# EAGLE design my_dac_amp_vB (EAGLE 6.4)
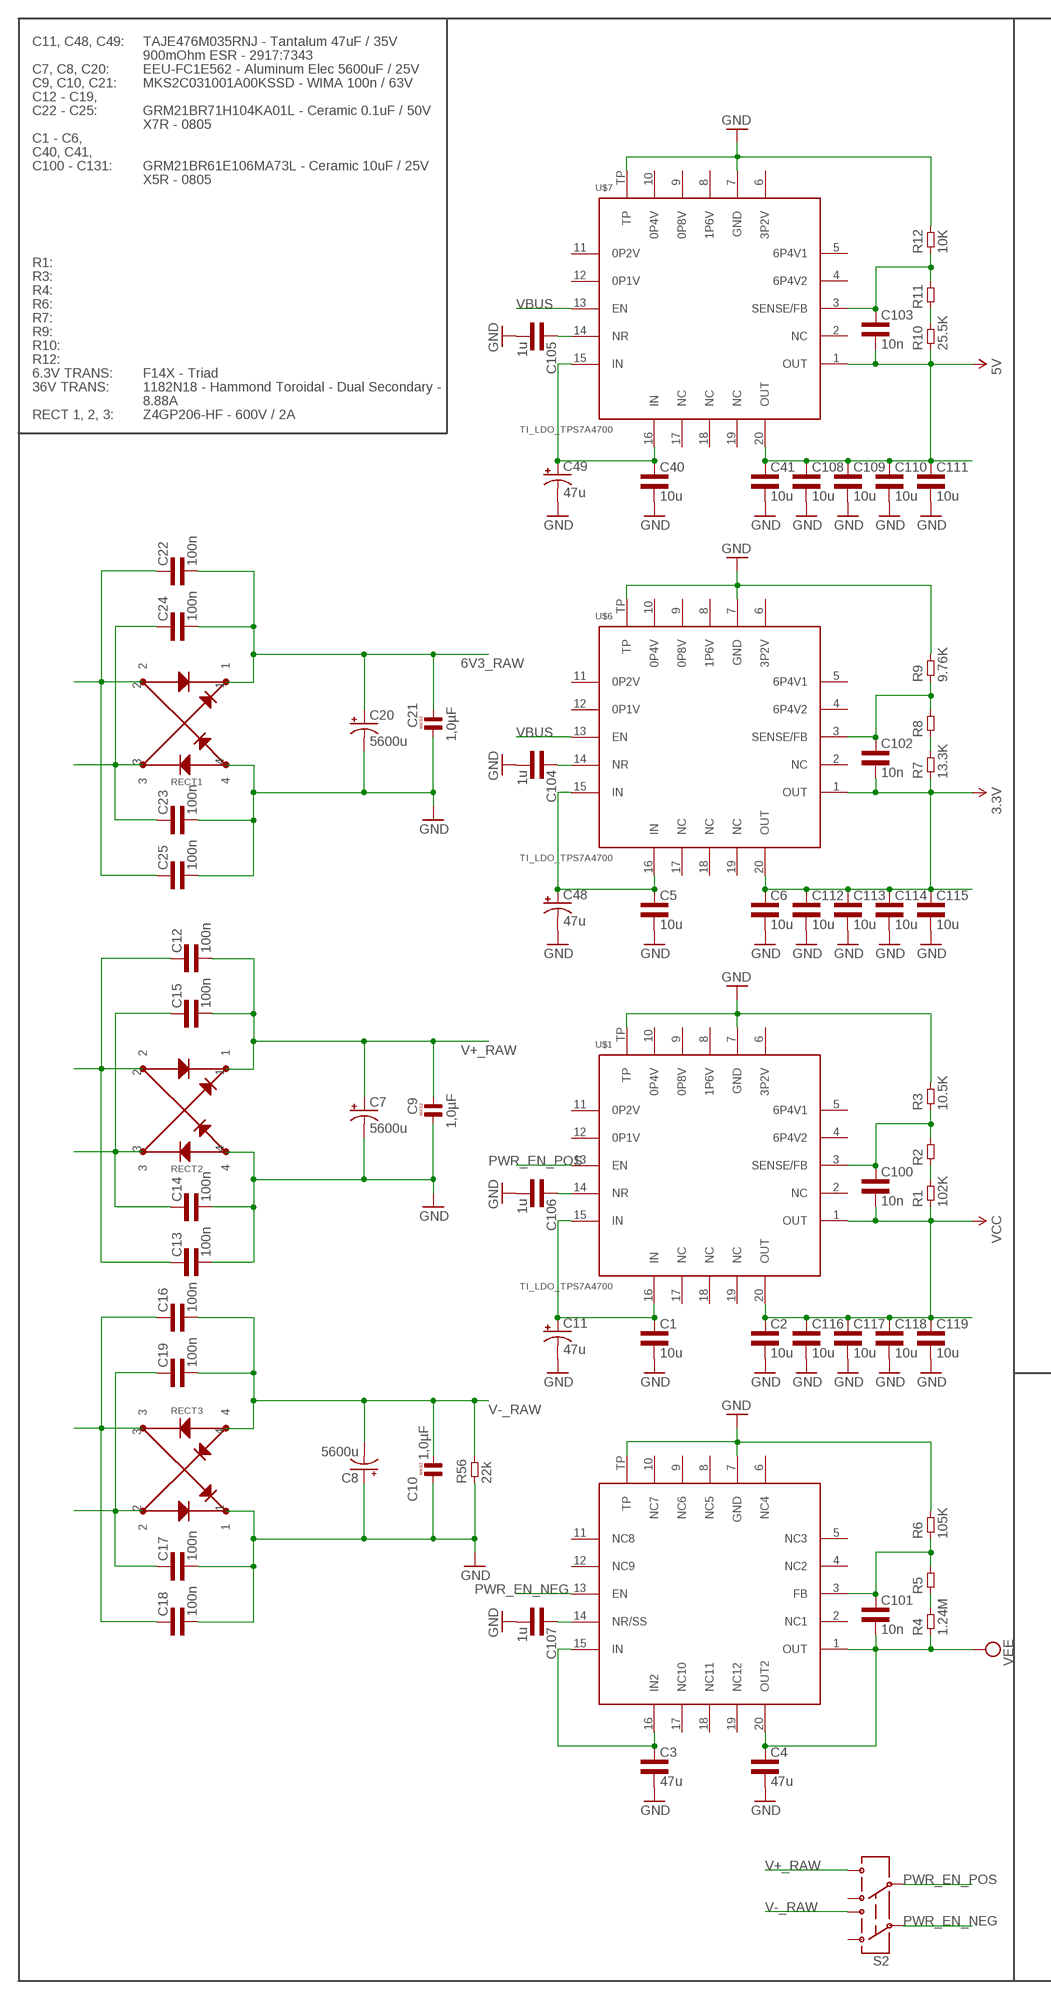
[diagram p0: schematic, sheet 1, part 1 of 2]
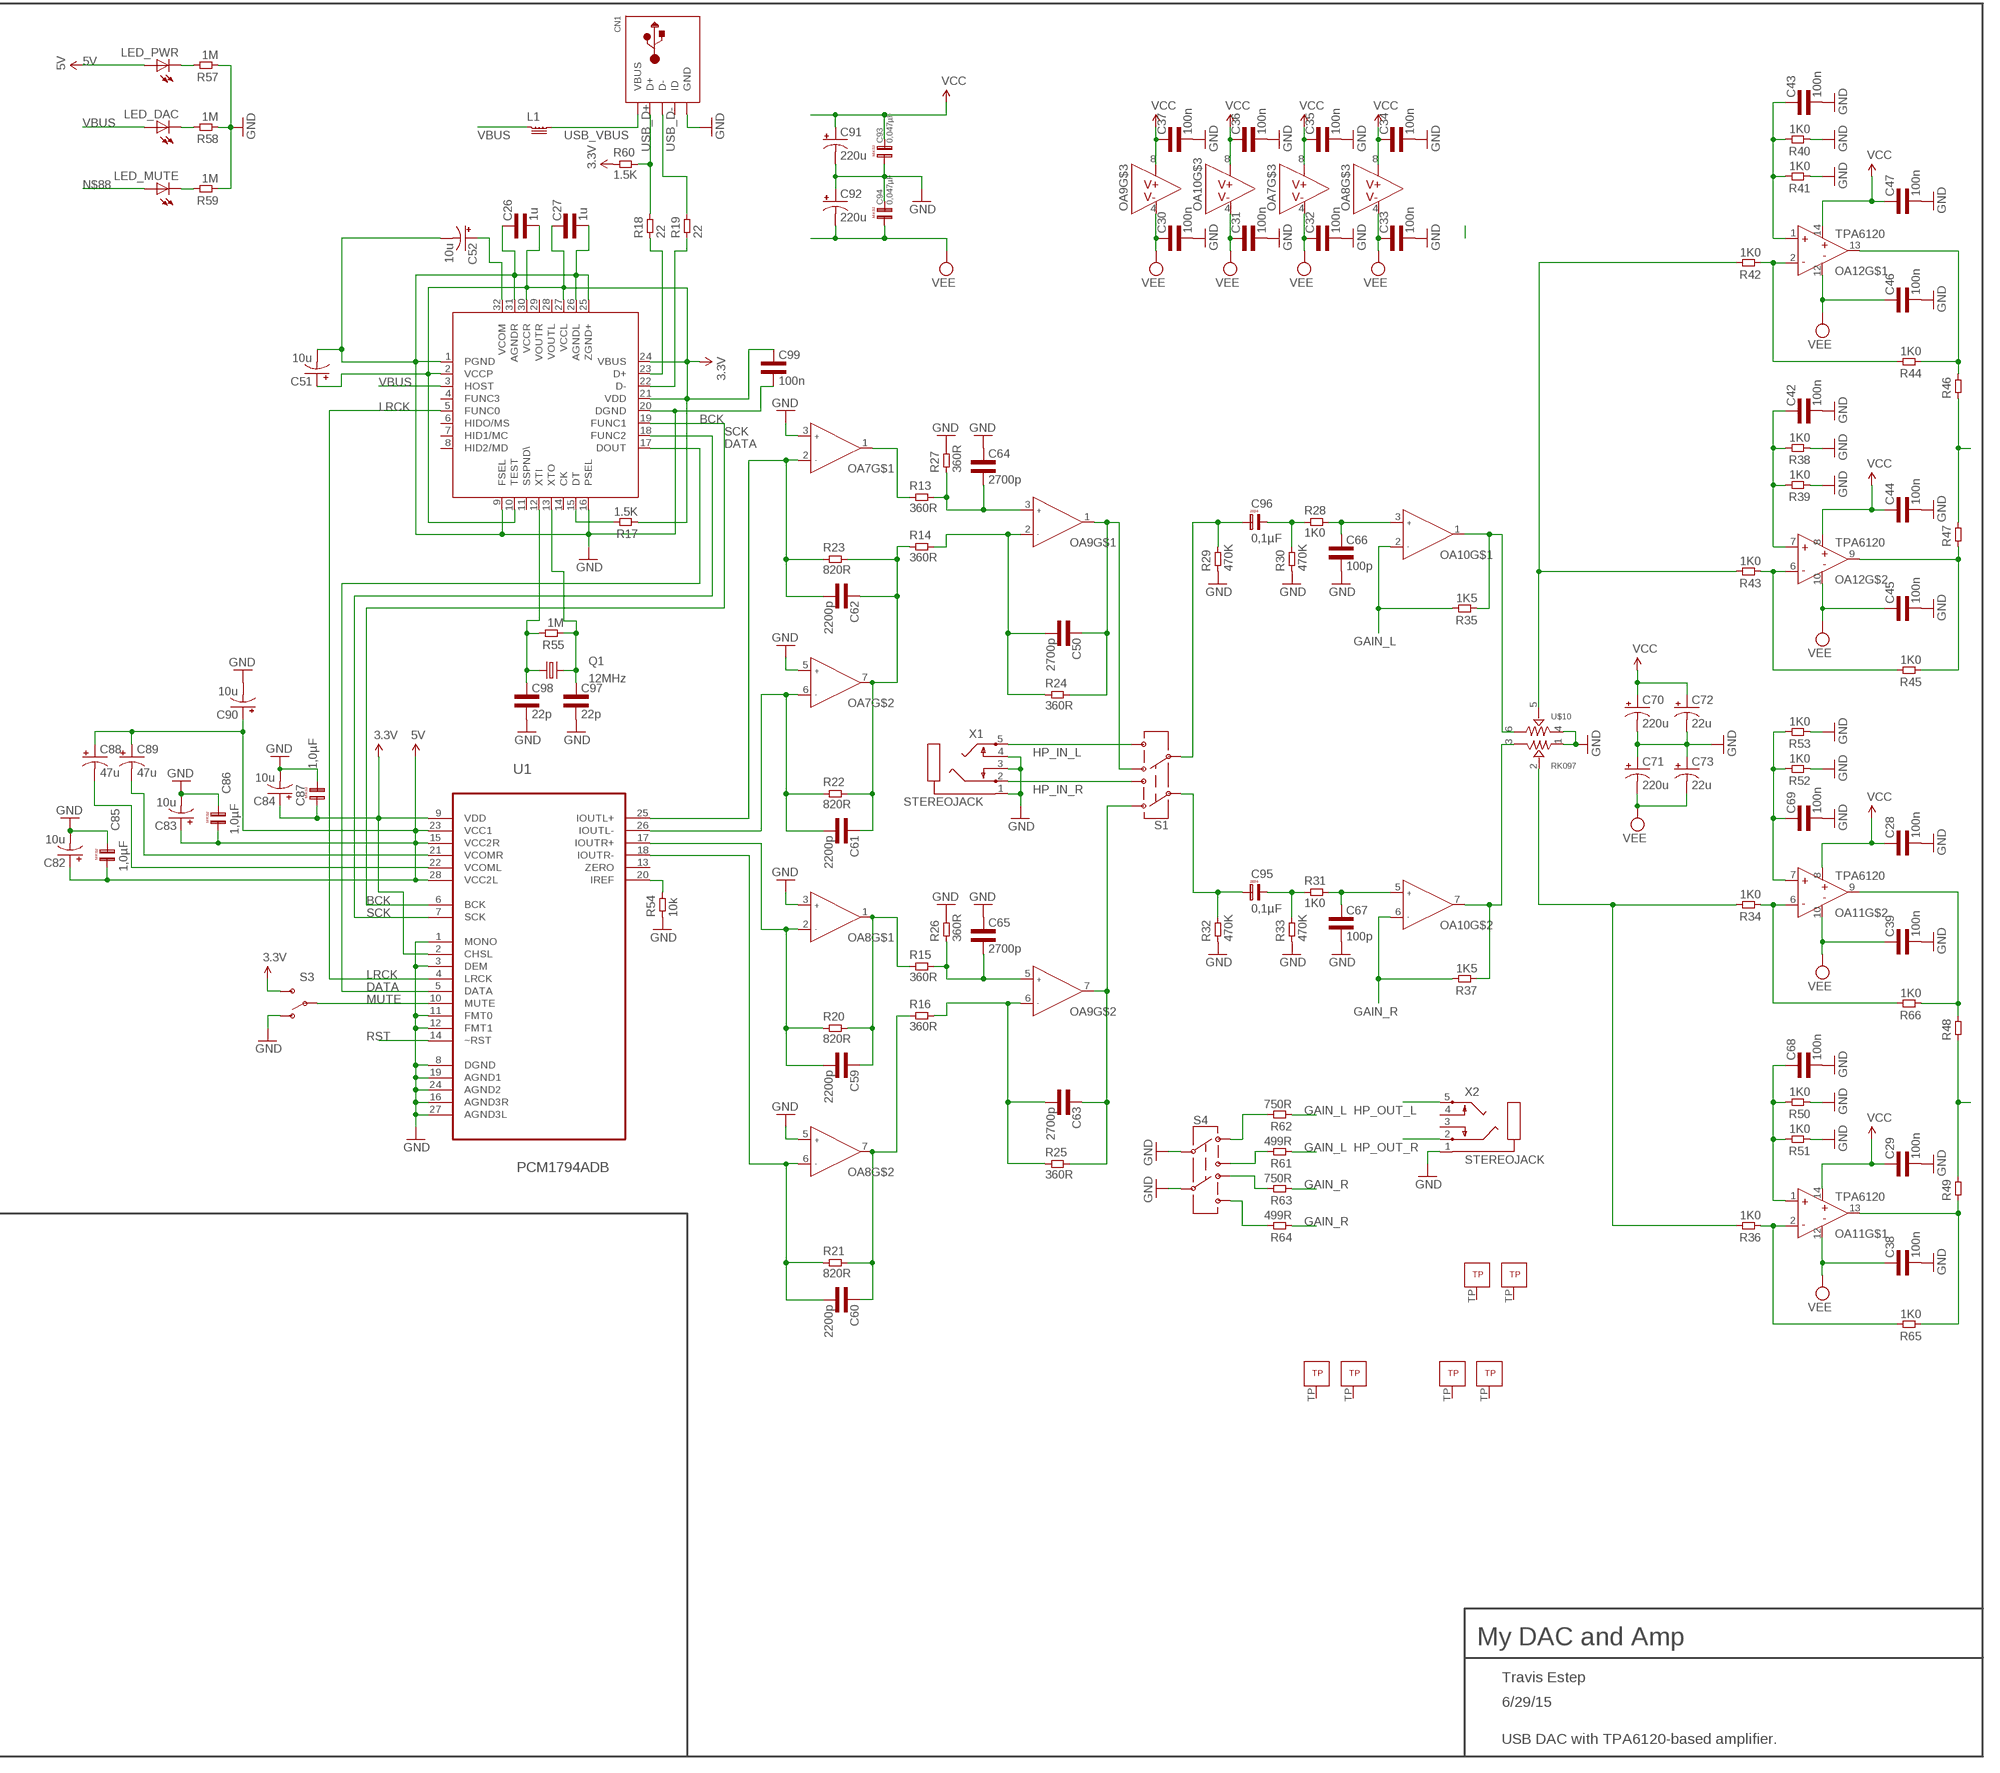
[diagram p1: schematic, sheet 1, part 2 of 2]

## Parts
C1  10u  CAP1206L3  [1206L3]
C2  10u  CAP0805L3  [0805L3]
C3  47u  CAP1206L3  [1206L3]
C4  47u  CAP1206L3  [1206L3]
C5  10u  CAP1206L3  [1206L3]
C6  10u  CAP0805L3  [0805L3]
C7  5600u  CPOL-USE7.5-16  [E7,5-16]
C8  5600u  CPOL-USE7.5-16  [E7,5-16]
C9  1,0µF  [R5B5]
C10  1,0µF  [R5B5]
C11  47u  CPOL-USSMCE  [SMC_E]
C12  100n  CAP0805L3  [0805L3]
C13  100n  CAP0805L3  [0805L3]
C14  100n  CAP0805L3  [0805L3]
C15  100n  CAP0805L3  [0805L3]
C16  100n  CAP0805L3  [0805L3]
C17  100n  CAP0805L3  [0805L3]
C18  100n  CAP0805L3  [0805L3]
C19  100n  CAP0805L3  [0805L3]
C20  5600u  CPOL-USE7.5-16  [E7,5-16]
C21  1,0µF  [R5B5]
C22  100n  CAP0805L3  [0805L3]
C23  100n  CAP0805L3  [0805L3]
C24  100n  CAP0805L3  [0805L3]
C25  100n  CAP0805L3  [0805L3]
C26  1u  CAP0603L3  [0603L3]
C27  1u  CAP0603L3  [0603L3]
C28  100n  CAP0603L3  [0603L3]
C29  100n  CAP0603L3  [0603L3]
C30  100n  CAP0603L3  [0603L3]
C31  100n  CAP0603L3  [0603L3]
C32  100n  CAP0603L3  [0603L3]
C33  100n  CAP0603L3  [0603L3]
C34  100n  CAP0603L3  [0603L3]
C35  100n  CAP0603L3  [0603L3]
C36  100n  CAP0603L3  [0603L3]
C37  100n  CAP0603L3  [0603L3]
C38  100n  CAP0603L3  [0603L3]
C39  100n  CAP0603L3  [0603L3]
C40  10u  CAP1206L3  [1206L3]
C41  10u  CAP0805L3  [0805L3]
C42  100n  CAP0603L3  [0603L3]
C43  100n  CAP0603L3  [0603L3]
C44  100n  CAP0603L3  [0603L3]
C45  100n  CAP0603L3  [0603L3]
C46  100n  CAP0603L3  [0603L3]
C47  100n  CAP0603L3  [0603L3]
C48  47u  CPOL-USSMCE  [SMC_E]
C49  47u  CPOL-USSMCE  [SMC_E]
C50  2700p  CAP0603L3  [0603L3]
C51  10u  CPOL-USE3.5-8  [E3,5-8]
C52  10u  CPOL-USE3.5-8  [E3,5-8]
C59  2200p  CAP0603L3  [0603L3]
C60  2200p  CAP0603L3  [0603L3]
C61  2200p  CAP0603L3  [0603L3]
C62  2200p  CAP0603L3  [0603L3]
C63  2700p  CAP0603L3  [0603L3]
C64  2700p  CAP0603L3  [0603L3]
C65  2700p  CAP0603L3  [0603L3]
C66  100p  CAP0603L3  [0603L3]
C67  100p  CAP0603L3  [0603L3]
C68  100n  CAP0603L3  [0603L3]
C69  100n  CAP0603L3  [0603L3]
C70  220u  CPOL-USE5-13  [E5-13]
C71  220u  CPOL-USE5-13  [E5-13]
C72  22u  CPOL-USE3.5-8  [E3,5-8]
C73  22u  CPOL-USE3.5-8  [E3,5-8]
C82  10u  CPOL-USE3.5-8  [E3,5-8]
C83  10u  CPOL-USE3.5-8  [E3,5-8]
C84  10u  CPOL-USE3.5-8  [E3,5-8]
C85  1,0µF  [R5B5]
C86  1,0µF  [R5B5]
C87  1,0µF  [R5B5]
C88  47u  CPOL-USE5-10.5  [E5-10,5]
C89  47u  CPOL-USE5-10.5  [E5-10,5]
C90  10u  CPOL-USE3.5-8  [E3,5-8]
C91  220u  CPOL-USE5-13  [E5-13]
C92  220u  CPOL-USE5-13  [E5-13]
C93  0,047µF  [R5B2K5]
C94  0,047µF  [R5B2K5]
C95  0,1µF  [L7,2]
C96  0,1µF  [L7,2]
C97  22p  CAP0603L3  [0603L3]
C98  22p  CAP0603L3  [0603L3]
C99  100n  CAP0603L3  [0603L3]
C100  10n  CAP0603L3  [0603L3]
C101  10n  CAP0603L3  [0603L3]
C102  10n  CAP0603L3  [0603L3]
C103  10n  CAP0603L3  [0603L3]
C104  1u  CAP0603L3  [0603L3]
C105  1u  CAP0603L3  [0603L3]
C106  1u  CAP0603L3  [0603L3]
C107  1u  CAP0603L3  [0603L3]
C108  10u  CAP0805L3  [0805L3]
C109  10u  CAP0805L3  [0805L3]
C110  10u  CAP0805L3  [0805L3]
C111  10u  CAP0805L3  [0805L3]
C112  10u  CAP0805L3  [0805L3]
C113  10u  CAP0805L3  [0805L3]
C114  10u  CAP0805L3  [0805L3]
C115  10u  CAP0805L3  [0805L3]
C116  10u  CAP0805L3  [0805L3]
C117  10u  CAP0805L3  [0805L3]
C118  10u  CAP0805L3  [0805L3]
C119  10u  CAP0805L3  [0805L3]
CN1  USBMINIB  [USB-MINIB]
L1  SRP4020  [4440]
LED_DAC  LED3MM  [LED3MM]
LED_MUTE  LED3MM  [LED3MM]
LED_PWR  LED3MM  [LED3MM]
OA7  OPA1612  [S-PWSON-N8]
OA8  OPA1612  [S-PWSON-N8]
OA9  OPA1612  [S-PWSON-N8]
OA10  OPA1612  [S-PWSON-N8]
OA11  TPA6120QFN  [S-PVQFN-N14]
OA12  TPA6120QFN  [S-PVQFN-N14]
Q1  12MHz  SPARKFUN_CRYSTALHC49US  [SPARKFUN_HC49US]
R1  102K  RES0603L3  [0603L3]
R2  RES0603L3  [0603L3]
R3  10.5K  RES0603L3  [0603L3]
R4  1.24M  RES0603L3  [0603L3]
R5  RES0603L3  [0603L3]
R6  105K  RES0603L3  [0603L3]
R7  13.3K  RES0603L3  [0603L3]
R8  RES0603L3  [0603L3]
R9  9.76K  RES0603L3  [0603L3]
R10  25.5K  RES0603L3  [0603L3]
R11  RES0603L3  [0603L3]
R12  10K  RES0603L3  [0603L3]
R13  360R  RES0603L3  [0603L3]
R14  360R  RES0603L3  [0603L3]
R15  360R  RES0603L3  [0603L3]
R16  360R  RES0603L3  [0603L3]
R17  1.5K  RES0603L3  [0603L3]
R18  22  RES0603L3  [0603L3]
R19  22  RES0603L3  [0603L3]
R20  820R  RES0603L3  [0603L3]
R21  820R  RES0603L3  [0603L3]
R22  820R  RES0603L3  [0603L3]
R23  820R  RES0603L3  [0603L3]
R24  360R  RES0603L3  [0603L3]
R25  360R  RES0603L3  [0603L3]
R26  360R  RES0603L3  [0603L3]
R27  360R  RES0603L3  [0603L3]
R28  1K0  RES0603L3  [0603L3]
R29  470K  RES0603L3  [0603L3]
R30  470K  RES0603L3  [0603L3]
R31  1K0  RES0603L3  [0603L3]
R32  470K  RES0603L3  [0603L3]
R33  470K  RES0603L3  [0603L3]
R34  1K0  RES0603L3  [0603L3]
R35  1K5  RES0603L3  [0603L3]
R36  1K0  RES0603L3  [0603L3]
R37  1K5  RES0603L3  [0603L3]
R38  1K0  RES0603L3  [0603L3]
R39  1K0  RES0603L3  [0603L3]
R40  1K0  RES0603L3  [0603L3]
R41  1K0  RES0603L3  [0603L3]
R42  1K0  RES0603L3  [0603L3]
R43  1K0  RES0603L3  [0603L3]
R44  1K0  RES0603L3  [0603L3]
R45  1K0  RES0603L3  [0603L3]
R46  RES1206L3  [1206L3]
R47  RES1206L3  [1206L3]
R48  RES1206L3  [1206L3]
R49  RES1206L3  [1206L3]
R50  1K0  RES0603L3  [0603L3]
R51  1K0  RES0603L3  [0603L3]
R52  1K0  RES0603L3  [0603L3]
R53  1K0  RES0603L3  [0603L3]
R54  10k  RES0603L3  [0603L3]
R55  1M  RES0603L3  [0603L3]
R56  22k  RES0805L3  [0805L3]
R57  1M  RES0603L3  [0603L3]
R58  1M  RES0603L3  [0603L3]
R59  1M  RES0603L3  [0603L3]
R60  1.5K  RES0603L3  [0603L3]
R61  499R  RES0603L3  [0603L3]
R62  750R  RES0603L3  [0603L3]
R63  750R  RES0603L3  [0603L3]
R64  499R  RES0603L3  [0603L3]
R65  1K0  RES0603L3  [0603L3]
R66  1K0  RES0603L3  [0603L3]
RECT1  Z4GP206  [ABS-4]
RECT2  Z4GP206  [ABS-4]
RECT3  Z4GP206  [ABS-4]
S1  SWITCH-DPDTOS  [OS]
S2  SWITCH-DPDTOS  [OS]
S3  SWITCH-SPDTKIT  [SWITCH-SPDT_KIT]
S4  SWITCH-DPDTOS  [OS]
U1  PCM1794ADB  [SOP65P780X200-28N]
U$1  TI_LDO_TPS7A4700  [TI_LDO_VQFN-20]
U$2  TI_LDO_TPS7A3301RGWT  [TI_LDO_VQFN-20]
U$3  PCM2704C_PCM2707  [PCM2704C_PCM2707]
U$6  TI_LDO_TPS7A4700  [TI_LDO_VQFN-20]
U$7  TI_LDO_TPS7A4700  [TI_LDO_VQFN-20]
U$10  RK097  [RK097]
X1  STEREOJACK  [STX3100]
X2  STEREOJACK  [STX3100]

## Nets
3.3V: C6.1 C26.P$2 C27.P$1 C51.+ C84.+ C87.1 C99.P$1 C102.P$2 C112.1 C113.1 C114.1 C115.1 R7.P$1 R17.P$1 R60.P$1 S3.3(S) U1.2(CHSL) U1.9(VDD) U$3.2(VCCP) U$3.10(TEST) U$3.21(VDD) U$3.24(VBUS) U$3.27(VCCL) U$3.30(VCCR) U$6.1(OUT) U$6.20(OUT)
5V: C41.1 C82.+ C83.+ C85.1 C86.1 C88.+ C89.+ C90.+ C103.P$2 C108.1 C109.1 C110.1 C111.1 LED_PWR.A R10.P$1 U1.15(VCC2R) U1.23(VCC1) U1.28(VCC2L) U$7.1(OUT) U$7.20(OUT)
6V3_RAW: C5.1 C20.+ C21.2 C22.2 C24.2 C40.1 C48.+ C49.+ RECT1.1 U$6.15(IN) U$6.16(IN) U$7.15(IN) U$7.16(IN)
BCK: U1.6(BCK) U$3.19(FUNC1)
D+: R18.P$1 U$3.23(D+)
D-: R19.P$1 U$3.22(D-)
DATA: U1.5(DATA) U$3.17(DOUT)
GAIN_L: OA10.2(INA-) R35.P$2 R61.P$1 R62.P$1
GAIN_R: OA10.6(INB-) R37.P$2 R63.P$1 R64.P$1
GND: C1.2 C2.2 C3.2 C4.2 C5.2 C6.2 C7.- C8.+ C9.1 C10.1 C11.- C13.2 C14.2 C17.2 C18.2 C20.- C21.1 C23.2 C25.2 C26.P$1 C27.P$2 C28.P$2 C29.P$2 C30.P$2 C31.P$2 C32.P$2 C33.P$2 C34.P$2 C35.P$2 C36.P$2 C37.P$2 C38.P$2 C39.P$2 C40.2 C41.2 C42.P$2 C43.P$2 C44.P$2 C45.P$2 C46.P$2 C47.P$2 C48.- C49.- C51.- C52.- C64.P$1 C65.P$1 C66.P$2 C67.P$2 C68.P$2 C69.P$2 C70.- C71.+ C72.- C73.+ C82.- C83.- C84.- C85.2 C86.2 C87.2 C90.- C91.- C92.+ C93.1 C94.2 C97.P$2 C98.P$2 C99.P$2 C104.P$2 C105.P$2 C106.P$2 C107.P$2 C108.2 C109.2 C110.2 C111.2 C112.2 C113.2 C114.2 C115.2 C116.2 C117.2 C118.2 C119.2 CN1.GND OA7.3(INA+) OA7.5(INB+) OA8.3(INA+) OA8.5(INB+) R3.P$2 R6.P$2 R9.P$2 R12.P$2 R26.P$2 R27.P$2 R29.P$1 R30.P$1 R32.P$1 R33.P$1 R38.P$1 R39.P$1 R40.P$1 R41.P$1 R50.P$1 R51.P$1 R52.P$1 R53.P$1 R54.P$1 R56.1 R57.P$1 R58.P$1 R59.P$1 RECT1.4 RECT2.4 RECT3.1 S3.1(O) S4.2 S4.5 U1.1(MONO) U1.3(DEM) U1.8(DGND) U1.11(FMT0) U1.12(FMT1) U1.16(AGND3R) U1.19(AGND1) U1.24(AGND2) U1.27(AGND3L) U$1.7(GND) U$1.TP U$2.7(GND) U$2.TP U$3.1(PGND) U$3.9(FSEL) U$3.16(PSEL) U$3.20(DGND) U$3.25(ZGND+) U$3.26(AGNDL) U$3.31(AGNDR) U$6.7(GND) U$6.TP U$7.7(GND) U$7.TP U$10.1 U$10.4 X1.1 X1.3 X1.4 X2.1
HP_IN_L: S1.6 X1.5
HP_IN_R: S1.3 X1.2
HP_OUT_L: R46.1 R47.2 X2.5
HP_OUT_R: R48.1 R49.2 X2.2
LRCK: U1.4(LRCK) U$3.5(FUNC0)
MUTE: S3.2(P) U1.10(MUTE)
N$1: R10.P$2 R11.P$1
N$2: R1.P$2 R2.P$1
N$3: C100.P$1 R2.P$2 R3.P$1 U$1.3(SENSE/FB)
N$4: LED_PWR.K(C) R57.P$2
N$5: LED_DAC.K(C) R58.P$2
N$6: C103.P$1 R11.P$2 R12.P$1 U$7.3(SENSE/FB)
N$7: R4.P$2 R5.P$1
N$8: C101.P$1 R5.P$2 R6.P$1 U$2.3(FB)
N$9: C62.P$2 OA7.2(INA-) R23.P$1 U1.25(IOUTL+)
N$10: C42.P$1 OA12.7(IN+) R38.P$2 R39.P$2
N$11: C43.P$1 OA12.1(IN+) R40.P$2 R41.P$2
N$12: C12.1 C13.1 RECT2.2
N$13: C14.1 C15.1 RECT2.3
N$14: OA7.1(OUTA) R13.P$1
N$15: C61.P$1 C62.P$1 OA7.7(OUTB) R14.P$1 R22.P$2 R23.P$2
N$16: C50.P$1 OA9.1(OUTA) R24.P$2 S1.4
N$17: R7.P$2 R8.P$1
N$18: C102.P$1 R8.P$2 R9.P$1 U$6.3(SENSE/FB)
N$19: R62.P$2 S4.1
N$20: C63.P$1 OA9.7(OUTB) R25.P$2 S1.1
N$21: C59.P$2 OA8.2(INA-) R20.P$1 U1.17(IOUTR+)
N$22: C60.P$2 OA8.6(INB-) R21.P$1 U1.18(IOUTR-)
N$23: C23.1 C24.1 RECT1.3
N$24: C22.1 C25.1 RECT1.2
N$25: R61.P$2 S4.3
N$26: C64.P$2 OA9.3(INA+) R13.P$2 R27.P$1
N$27: OA12.2(IN-) R42.P$1 R44.P$2
N$28: OA12.6(IN-) R43.P$1 R45.P$2
N$29: OA10.7(OUTB) R37.P$1 U$10.3
N$30: C59.P$1 OA8.1(OUTA) R15.P$1 R20.P$2
N$31: C61.P$2 OA7.6(INB-) R22.P$1 U1.26(IOUTL-)
N$32: C52.+ U$3.32(VCOM)
N$33: R17.P$2 U$3.15(DT)
N$34: C63.P$2 OA9.6(INB-) R16.P$2 R25.P$1
N$35: C60.P$1 OA8.7(OUTB) R16.P$1 R21.P$2
N$36: OA11.13(OUT) R49.1 R65.P$1
N$37: OA11.2(IN-) R36.P$1 R65.P$2
N$38: OA11.9(OUT) R48.2 R66.P$1
N$39: OA11.6(IN-) R34.P$1 R66.P$2
N$40: R34.P$2 R36.P$2 U$10.2
N$41: OA12.13(OUT) R44.P$1 R46.2
N$42: OA12.9(OUT) R45.P$1 R47.1
N$48: C96.P$2 R28.P$1 R30.P$2
N$49: C66.P$1 OA10.3(INA+) R28.P$2
N$50: C65.P$2 OA9.5(INB+) R15.P$2 R26.P$1
N$51: C107.P$1 U$2.14(NR/SS)
N$52: C106.P$1 U$1.14(NR)
N$53: C50.P$2 OA9.2(INA-) R14.P$2 R24.P$1
N$54: C104.P$1 U$6.14(NR)
N$55: C105.P$1 U$7.14(NR)
N$56: C95.P$2 R31.P$1 R33.P$2
N$57: C67.P$1 OA10.5(INB+) R31.P$2
N$62: C68.P$1 OA11.1(IN+) R50.P$2 R51.P$2
N$66: C96.P$1 R29.P$2 S1.5
N$67: C95.P$1 R32.P$2 S1.2
N$72: C16.1 C18.1 RECT3.3
N$73: C69.P$1 OA11.7(IN+) R52.P$2 R53.P$2
N$74: R42.P$2 R43.P$2 U$10.5
N$77: C17.1 C19.1 RECT3.2
N$78: C89.- U1.21(VCOMR)
N$79: C88.- U1.22(VCOML)
N$80: C98.P$1 Q1.1 R55.P$2 U$3.12(XTI)
N$81: OA10.1(OUTA) R35.P$1 U$10.6
N$82: C97.P$1 Q1.2 R55.P$1 U$3.13(XTO)
N$83: LED_MUTE.K(C) R59.P$2
N$84: R54.P$2 U1.20(IREF)
N$85: R63.P$2 S4.4
N$86: R64.P$2 S4.6
N$88: LED_MUTE.A
PWR_EN_NEG: S2.2 U$2.13(EN)
PWR_EN_POS: S2.5 U$1.13(EN)
RST: U1.14(~RST)
SCK: U1.7(SCK) U$3.18(FUNC2)
USB_D+: CN1.D+ R18.P$2 R60.P$2
USB_D-: CN1.D- R19.P$2
USB_VBUS: CN1.VBUS L1.2
V+_RAW: C1.1 C7.+ C9.2 C11.+ C12.2 C15.2 RECT2.1 S2.6 U$1.15(IN) U$1.16(IN)
V-_RAW: C3.1 C8.- C10.2 C16.2 C19.2 R56.2 RECT3.4 S2.3 U$2.15(IN) U$2.16(IN2)
VBUS: L1.1 LED_DAC.A U$3.3(HOST) U$6.13(EN) U$7.13(EN)
VCC: C2.1 C28.P$1 C29.P$1 C34.P$1 C35.P$1 C36.P$1 C37.P$1 C44.P$1 C47.P$1 C70.+ C72.+ C91.+ C93.2 C100.P$2 C116.1 C117.1 C118.1 C119.1 OA7.8(V+) OA8.8(V+) OA9.8(V+) OA10.8(V+) OA11.8(V+) OA11.14(V+) OA12.8(V+) OA12.14(V+) R1.P$1 U$1.1(OUT) U$1.20(OUT)
VEE: C4.1 C30.P$1 C31.P$1 C32.P$1 C33.P$1 C38.P$1 C39.P$1 C45.P$1 C46.P$1 C71.- C73.- C92.- C94.1 C101.P$2 OA7.4(V-) OA8.4(V-) OA9.4(V-) OA10.4(V-) OA11.10(V-) OA11.12(V-) OA12.10(V-) OA12.12(V-) R4.P$1 U$2.1(OUT) U$2.20(OUT2)
Unconnected: CN1.ID OA7.TP OA8.TP OA9.TP OA10.TP OA11.TP OA12.TP S2.1 S2.4 U1.13(ZERO) U$1.2(NC) U$1.4(6P4V2) U$1.5(6P4V1) U$1.6(3P2V) U$1.8(1P6V) U$1.9(0P8V) U$1.10(0P4V) U$1.11(0P2V) U$1.12(0P1V) U$1.17(NC) U$1.18(NC) U$1.19(NC) U$2.2(NC1) U$2.4(NC2) U$2.5(NC3) U$2.6(NC4) U$2.8(NC5) U$2.9(NC6) U$2.10(NC7) U$2.11(NC8) U$2.12(NC9) U$2.17(NC10) U$2.18(NC11) U$2.19(NC12) U$3.4(FUNC3) U$3.6(HIDO/MS) U$3.7(HID1/MC) U$3.8(HID2/MD) U$3.11(SSPND\) U$3.14(CK) U$3.28(VOUTL) U$3.29(VOUTR) U$6.2(NC) U$6.4(6P4V2) U$6.5(6P4V1) U$6.6(3P2V) U$6.8(1P6V) U$6.9(0P8V) U$6.10(0P4V) U$6.11(0P2V) U$6.12(0P1V) U$6.17(NC) U$6.18(NC) U$6.19(NC) U$7.2(NC) U$7.4(6P4V2) U$7.5(6P4V1) U$7.6(3P2V) U$7.8(1P6V) U$7.9(0P8V) U$7.10(0P4V) U$7.11(0P2V) U$7.12(0P1V) U$7.17(NC) U$7.18(NC) U$7.19(NC) X2.3 X2.4

## Notes on the sheet
- C11, C48, C49: | TAJE476M035RNJ - Tantalum 47uF / 35V
- 900mOhm ESR - 2917:7343
- C7, C8, C20: | EEU-FC1E562 - Aluminum Elec 5600uF / 25V
- C9, C10, C21: | MKS2C031001A00KSSD - WIMA 100n / 63V
- C12 - C19,
- C22 - C25: | GRM21BR71H104KA01L - Ceramic 0.1uF / 50V
- X7R - 0805
- C1 - C6,
- C40, C41,
- C100 - C131: | GRM21BR61E106MA73L - Ceramic 10uF / 25V
- X5R - 0805
- R1:
- R3:
- R4:
- R6:
- R7:
- R9:
- R10:
- R12:
- 6.3V TRANS: | F14X - Triad
- 36V TRANS: | 1182N18 - Hammond Toroidal - Dual Secondary -
- 8.88A
- RECT 1, 2, 3: | Z4GP206-HF - 600V / 2A
- My DAC and Amp
- Travis Estep
- 6/29/15
- USB DAC with TPA6120-based amplifier.

## Library data of the parts
C1-C6 C12-C19 C22-C47 C50 C59-C69 C97-C119 = common:CAP
C7 C8 C11 C20 C48 C49 C51 C52 C70-C73 C82-C84 C88-C92 = rcl:CPOL-US: POLARIZED CAPACITOR, American symbol
C9 C10 C21 = Capacitor-Wima-MKS2-63v:1,0µF
C85-C87 = Capacitor-Wima-MKS2-50v:1,0µF
C93 C94 = Capacitor-Wima-MKS2-63v:0,047µF
C95 C96 = Capacitor-Wima-SMD2824-63v:0,1µF
CN1 = adafruit:USB: USB Connectors USBMINIB - Surface Mount Female Mini-B USB Connector 4UConnector: 06564 By microbuilder.eu Thru-hole RA Female Mini-B USB Connector 4UConnector: 18732 By ladyada.net
L1 = common:SRP4020
LED_DAC LED_MUTE LED_PWR = adafruit:LED: LED OSRAM: - CHIPLED LG R971, LG N971, LY N971, LG Q971, LY Q971, LO R971, LY R971 LH N974, LH R974 LS Q976, LO Q976, LY Q976 LO Q996 - Hyper CHIPLED LW Q18S LB Q993, LB Q99A, LB R99A - SideLED LS A670, LO A670, LY A670, LG A670, LP A670 LB A673, LV A673, LT A673, LW A673 LH A674 LY A675 LS A676, LA A676, LO A676, LY A676, LW A676 LS A679, LY A679, LG A679 - Hyper Micro SIDELED® LS Y876, LA Y876, LO Y876, LY Y876 LT Y87S - SmartLED LW L88C, LW L88S LB L89C, LB L89S, LG L890 LS L89K, LO L89K, LY L89K LS L896, LA L896, LO L896, LY L896 - TOPLED LS T670, LO T670, LY T670, LG T670, LP T670 LSG T670, LSP T670, LSY T670, LOP T670, LYG T670 LG T671, LOG T671, LSG T671 LB T673, LV T673, LT T673, LW T673 LH T674 LS T676, LA T676, LO T676, LY T676, LB T676, LH T676, LSB T676, LW T676 LB T67C, LV T67C, LT T67C, LS T67K, LO T67K, LY T67K, LW E67C LS E67B, LA E67B, LO E67B, LY E67B, LB E67C, LV E67C, LT E67C LW T67C LS T679, LY T679, LG T679 LS T770, LO T770, LY T770, LG T770, LP T770 LB T773, LV T773, LT T773, LW T773 LH T774 LS E675, LA E675, LY E675, LS T675 LS T776, LA T776, LO T776, LY T776, LB T776 LHGB T686 LT T68C, LB T68C - Hyper Mini TOPLED® LB M676 - Mini TOPLED Santana® LG M470 LS M47K, LO M47K, LY M47K Source: http://www.osram.convergy.de/
OA7-OA10 = common:OPA1612
OA11 OA12 = common:TPA6120
Q1 = pcm2707_v1:SPARKFUN_CRYSTAL: Crystals Various standard crystals. Proven footprints. Spark Fun Electronics SKU : COM-00534
R1-R66 = common:RES
RECT1-RECT3 = rectifier:Z4GP206
S1 S2 S4 = SparkFun-Electromechanical:SWITCH-DPDT: DPDT Version of the COM-00597
S3 = SparkFun-Electromechanical:SWITCH-SPDT: SPDT Switch Simple slide switch, Spark Fun Electronics SKU : COM-00102 DPDT SMT slide switch, AYZ0202, SWCH-08179
U1 = Texas Instruments_By_element14_Batch_1:PCM1794ADB: 24-Bit 192khz Sampling advanced segment Audio stereo digital-to-analog converter; MPN: PCM1794ADB; OC_FARNELL: 1755014; OC_NEWARK: 54K0199; PACKAGE: SSOP-28; SUPPLIER: Texas Instruments
U$1 U$6 U$7 = power-supply_pos_v1:TI_LDO_TPS7A4700
U$2 = power-supply_pos_v1:TI_LDO_TPS7A3301RGWT: Ultra-Low Noise NEGATIVE Voltage Reglator
U$3 = pcm2707_v1:PCM2704C_PCM2707: Upgraded version of the PCM2704. It allows connecting to a device with USB and transmitting that data to another DAC using I2S protocol. Also has other advanced features that allow control with SPI, external buttons, etc.
U$10 = SparkFun-Electromechanical:RK097
X1 X2 = adafruit:STEREOJACK: MIC/HEADPHONE JACK Stereo jack with two switches. Kycon STX3100, CUI SJ1-3555NG and/or 4UCon 05544

## Board
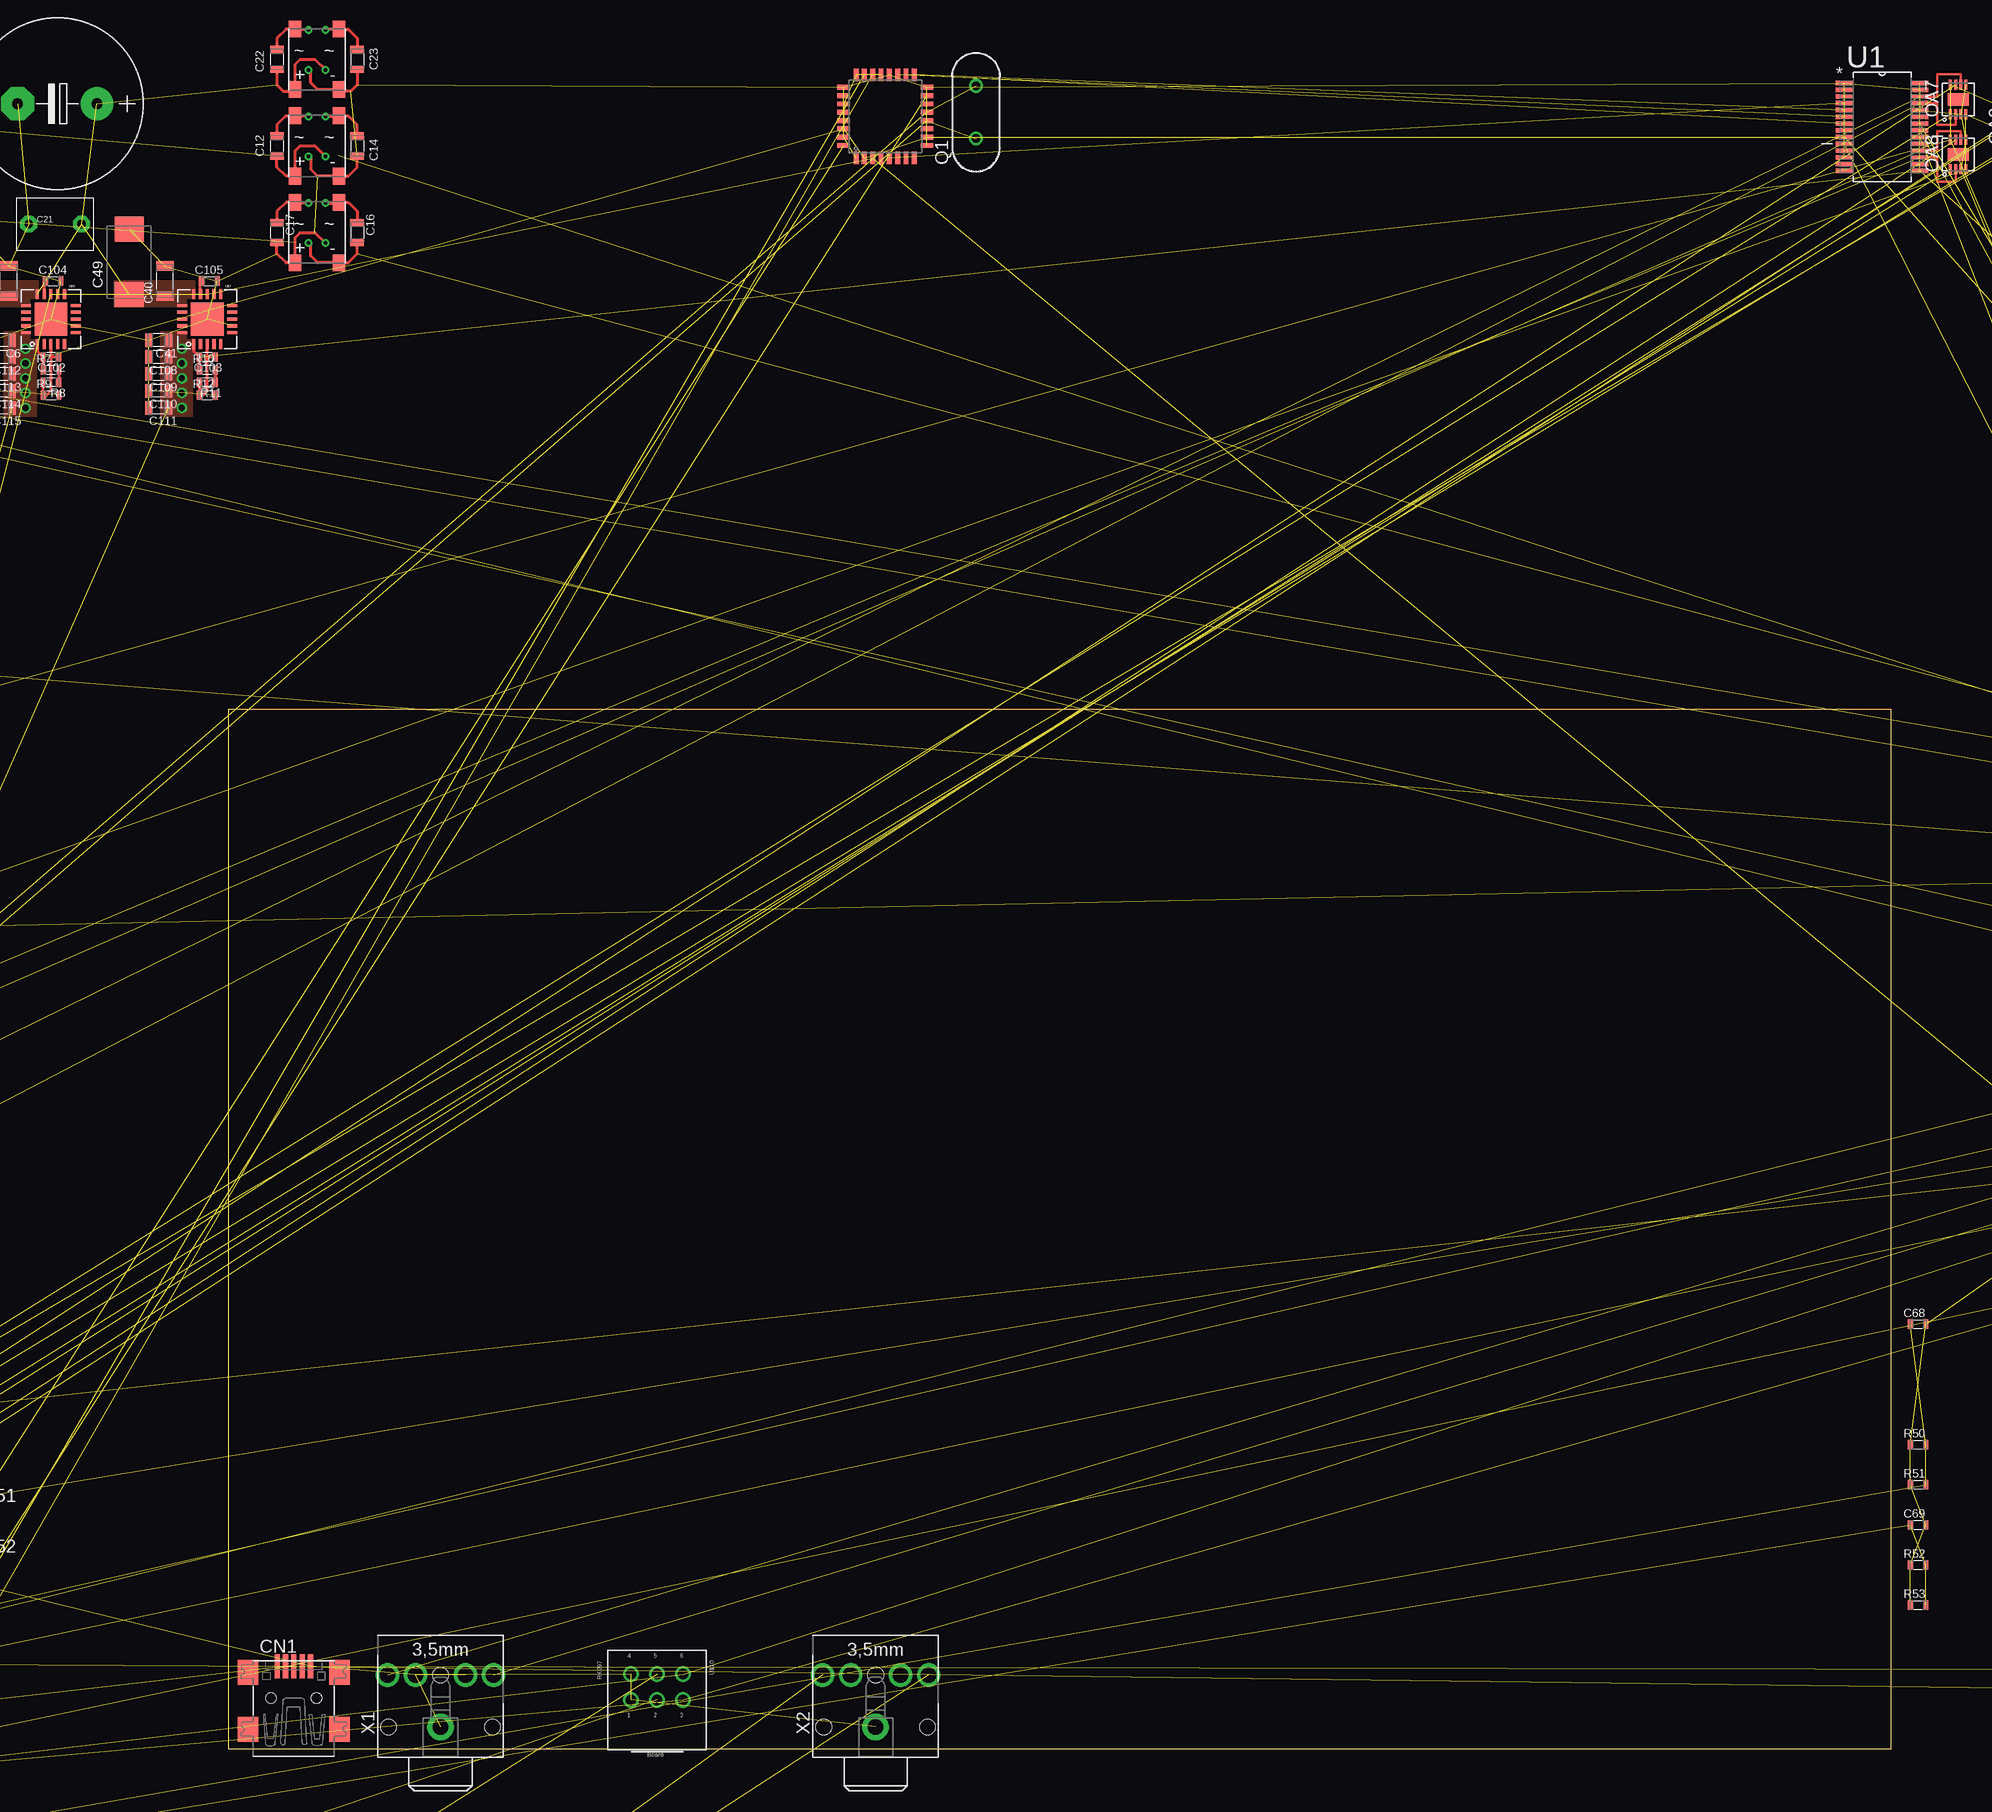
[diagram p2: board, top side]
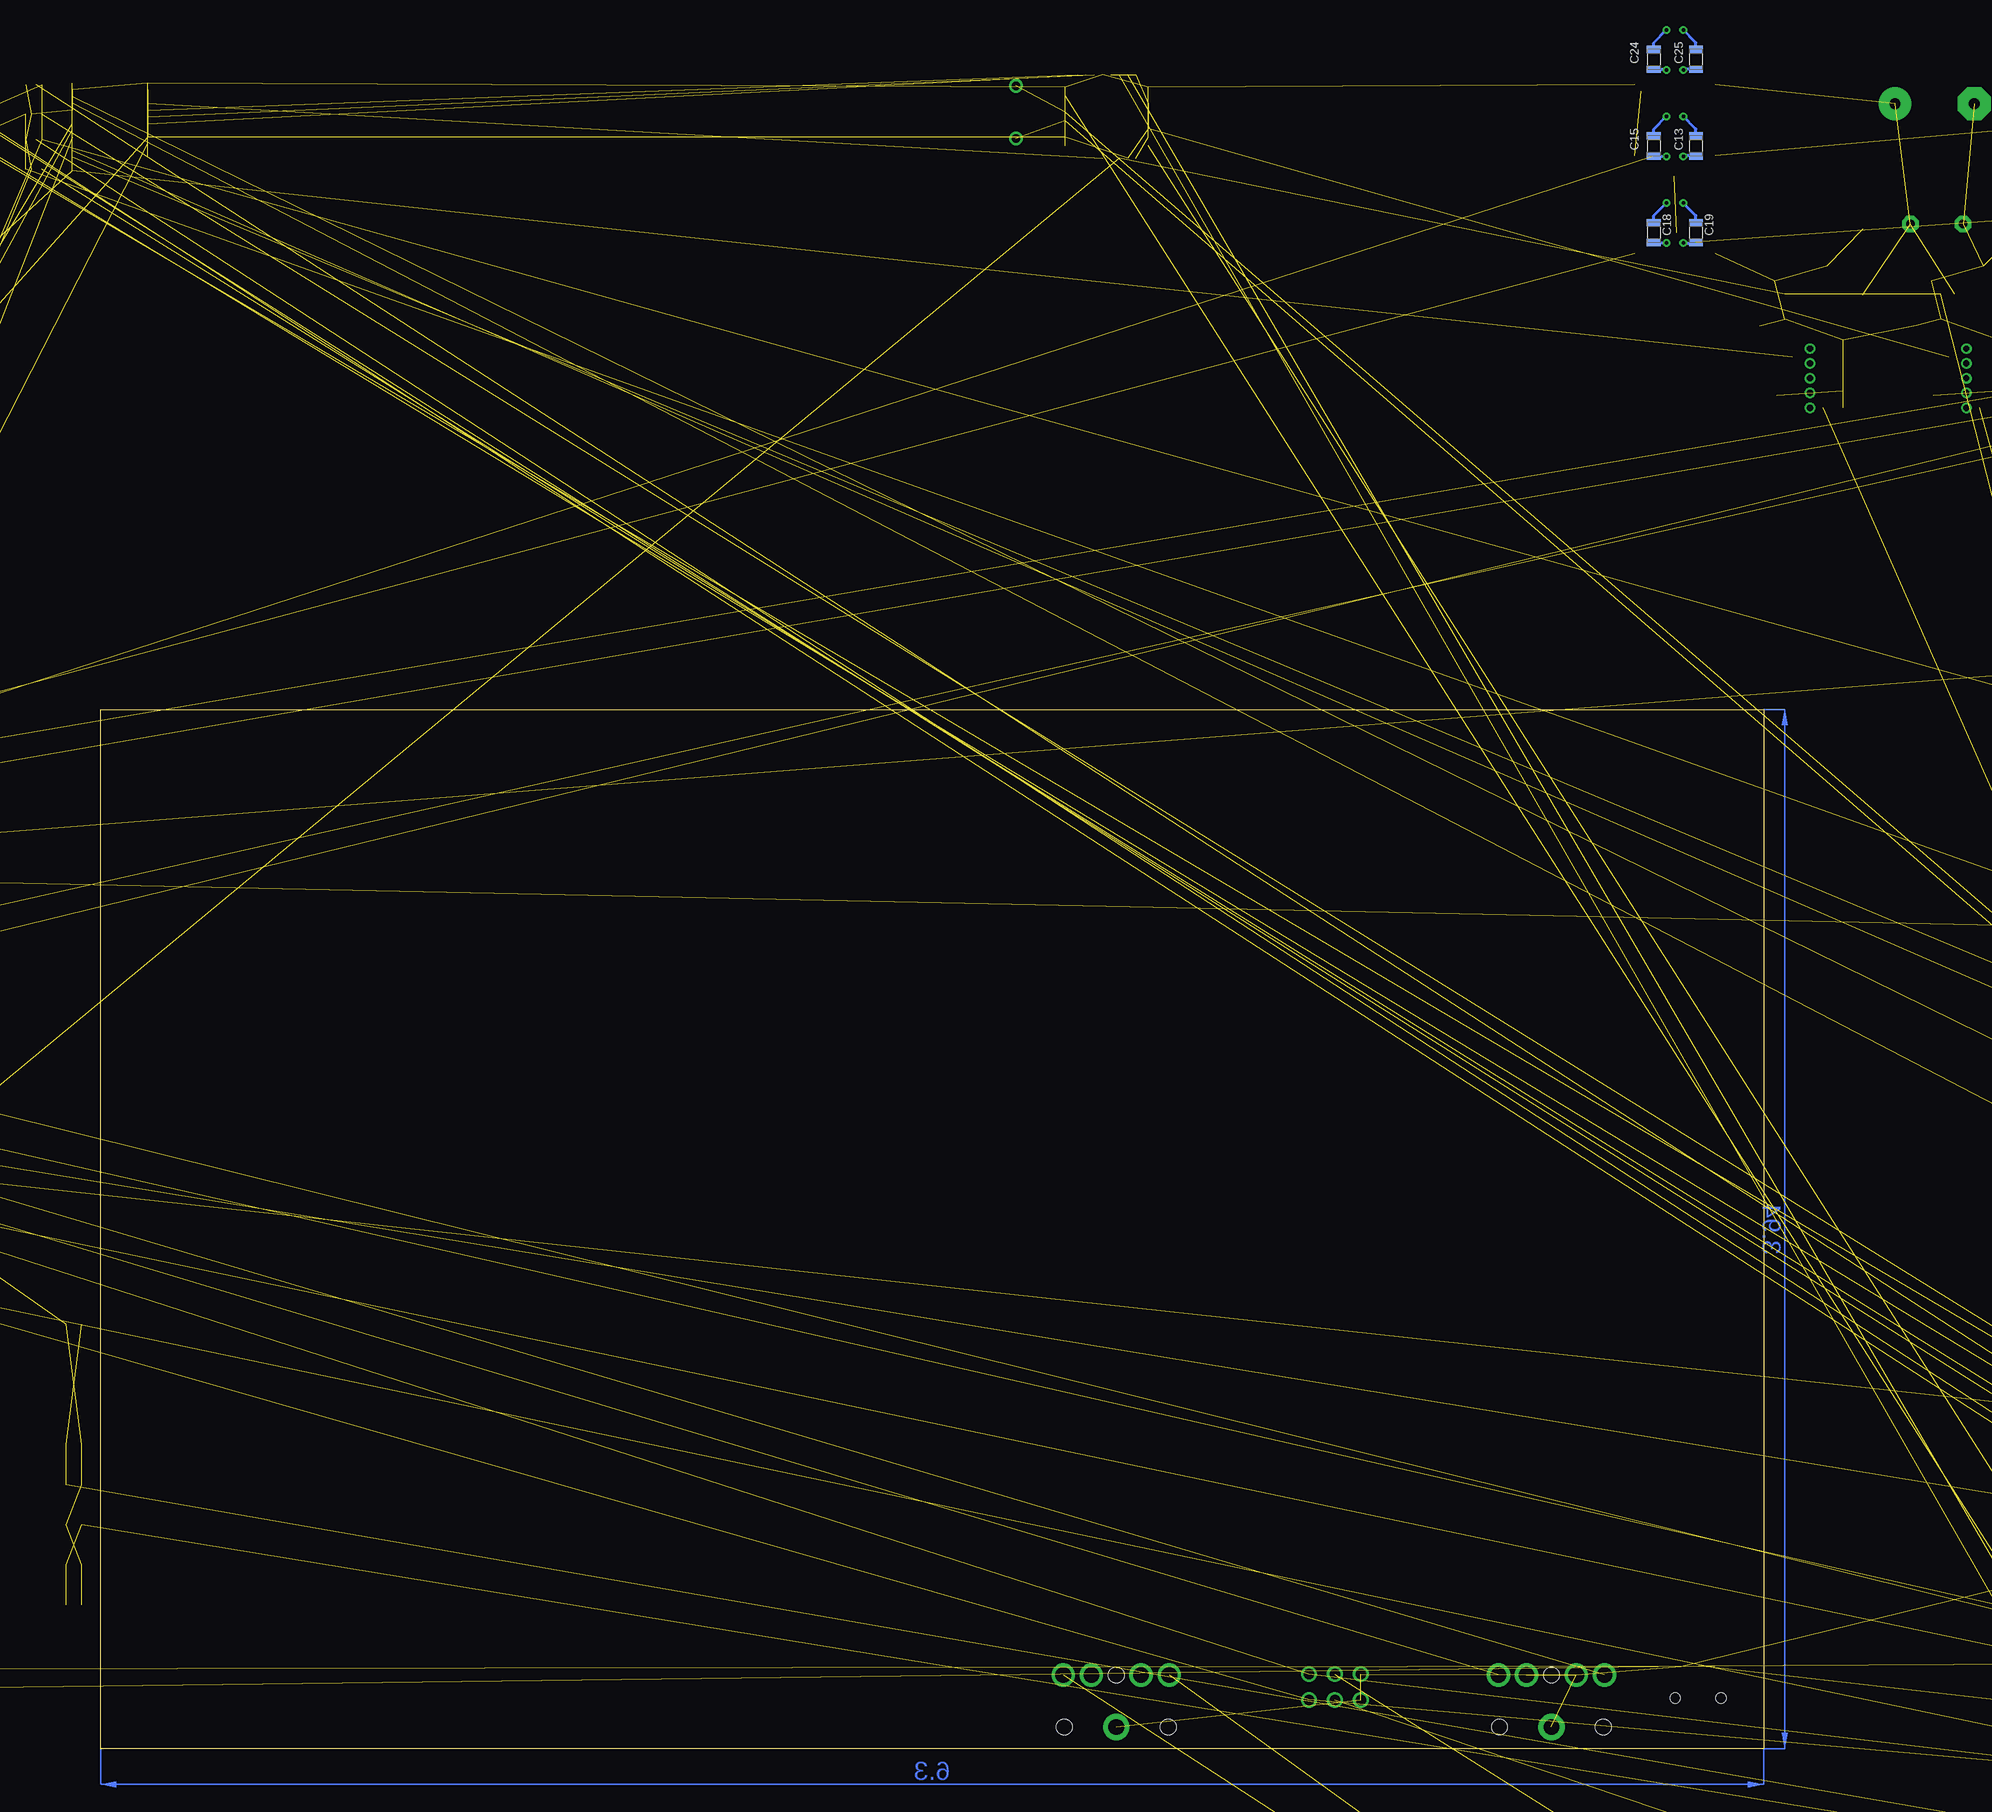
[diagram p3: board, bottom side, seen from below]

Size 160 x 100 mm. Coordinates in mm from the lower left corner, seen from the top.
Outline: 0,0 160,0 160,100 0,100 0,0
Copper layers (1*16): Top 0.035mm / dielectric 1.5mm / Bottom 0.035mm
Design rules "default": minimum track width 10mil, minimum drill 24mil, track to track 8mil, track to pad 8mil, pad to pad 8mil, via to via 8mil, smd to smd 8mil, copper to edge 40mil, drill to drill 8mil, minimum pad ring 10mil, minimum via ring 8mil, stop-mask expansion 4mil, vias tented up to drill 0mil, thermal gap 10mil

### Footprints (pad centres in the part's own frame; a part is rotated, then mirrored left to right if it is on the bottom)
1206L3 = smd 0.9 x 1.7: 1 -1.45,0; 2 1.45,0
0805L3 = smd 0.7 x 1.3: 1 -0.95,0; 2 0.95,0
E7,5-16 = drill 1.016 pad 3.15: + -3.81,0 | drill 1.016 pad 3.15 octagon: - 3.81,0
R5B5 = drill 0.813 pad 1.6 octagon: 1 -2.54,0; 2 2.54,0
SMC_E = smd 2.4 x 2.8: + -3.15,0; - 3.15,0
0603L3 = smd 0.5 x 0.9: P$1 -0.75,0; P$2 0.75,0
E3,5-8 = drill 0.813 pad 1.6: + -1.778,0 | drill 0.813 pad 1.6 octagon: - 1.778,0
E5-13 = drill 1.016 pad 2.54: + -2.54,0 | drill 1.016 pad 2.54 octagon: - 2.54,0
E5-10,5 = drill 1.016 pad 2.54: + -2.54,0 | drill 1.016 pad 2.54 octagon: - 2.54,0
R5B2K5 = drill 0.813 pad 1.6 octagon: 1 -2.54,0; 2 2.54,0
L7,2 = smd 4 x 1.2: P$1 0,-3.95; P$2 0,3.95
USB-MINIB = smd 0.5 x 2.308: D+ 0,4.064; D- -0.8,4.064; GND 1.6,4.064; ID 0.8,4.064; VBUS -1.6,4.064 | smd 2 x 2.4: GND1 -4.4,-2; GND2 -4.4,3.5; GND3 4.4,3.5; GND4 4.4,-2 | hole 1: -2.2,1; 2.2,1
4440 = smd 1.5 x 2.4: 1 -1.85,0; 2 1.85,0
LED3MM = drill 0.813 pad 1.676 octagon: A -1.27,0; K 1.27,0
S-PWSON-N8 = smd 0.28 x 0.95: 1 -0.75,-1.425; 2 -0.25,-1.425; 3 0.25,-1.425; 4 0.75,-1.425; 5 0.75,1.425; 6 0.25,1.425; 7 -0.25,1.425; 8 -0.75,1.425 | smd 2 x 1.2: TP 0,0
S-PVQFN-N14 = smd 0.85 x 0.28: 1 -1.725,-0.75; 7 1.725,-0.75; 8 1.725,0.75; 14 -1.725,0.75 | smd 0.28 x 0.85: 2 -1,-1.725; 3 -0.5,-1.725; 4 0,-1.725; 5 0.5,-1.725; 6 1,-1.725; 9 1,1.725; 10 0.5,1.725; 11 0,1.725; 12 -0.5,1.725; 13 -1,1.725 | smd 2.05 x 2.05: TP 0,0
SPARKFUN_HC49US = drill 0.813: 1 -2.54,0; 2 2.54,0
ABS-4 = smd 1.2 x 1.6: 1 2.1,2.91; 2 2.1,-2.91; 3 -2.1,-2.91; 4 -2.1,2.91
OS = drill 0.787 pad 1.27: 1 -2.007,1.245; 2 0,1.245; 3 2.007,1.245; 4 -2.007,-1.245; 5 0,-1.245; 6 2.007,-1.245
SWITCH-SPDT_KIT = drill 1.016 pad 1.88: 1 0,2.718; 2 0,0; 3 0,-2.718
SOP65P780X200-28N = smd 1.651 x 0.432: 1 -3.632,4.216; 2 -3.632,3.581; 3 -3.632,2.921; 4 -3.632,2.286; 5 -3.632,1.626; 6 -3.632,0.965; 7 -3.632,0.33; 8 -3.632,-0.33; 9 -3.632,-0.965; 10 -3.632,-1.626; 11 -3.632,-2.286; 12 -3.632,-2.921; 13 -3.632,-3.581; 14 -3.632,-4.216; 15 3.632,-4.216; 16 3.632,-3.581; 17 3.632,-2.921; 18 3.632,-2.286; 19 3.632,-1.626; 20 3.632,-0.965; 21 3.632,-0.33; 22 3.632,0.33; 23 3.632,0.965; 24 3.632,1.626; 25 3.632,2.286; 26 3.632,2.921; 27 3.632,3.581; 28 3.632,4.216
TI_LDO_VQFN-20 = smd 0.3 x 0.95: 1 -1.3,-2.4; 2 -0.65,-2.4; 3 0,-2.4; 4 0.65,-2.4; 5 1.3,-2.4; 11 1.3,2.4; 12 0.65,2.4; 13 0,2.4; 14 -0.65,2.4; 15 -1.3,2.4 | smd 0.95 x 0.3: 6 2.4,-1.3; 7 2.4,-0.65; 8 2.4,0; 9 2.4,0.65; 10 2.4,1.3; 16 -2.4,1.3; 17 -2.4,0.65; 18 -2.4,0; 19 -2.4,-0.65; 20 -2.4,-1.3 | smd 3.15 x 3.15: TP 0,0
PCM2704C_PCM2707 = smd 0.47 x 1.2: 1 -2.8,-4; 2 -2,-4; 3 -1.2,-4; 4 -0.4,-4; 5 0.4,-4; 6 1.2,-4; 7 2,-4; 8 2.8,-4; 17 2.8,4; 18 2,4; 19 1.2,4; 20 0.4,4; 21 -0.4,4; 22 -1.2,4; 23 -2,4; 24 -2.8,4 | smd 1.2 x 0.47: 9 4,-2.8; 10 4,-2; 11 4,-1.2; 12 4,-0.4; 13 4,0.4; 14 4,1.2; 15 4,2; 16 4,2.8; 25 -4,2.8; 26 -4,2; 27 -4,1.2; 28 -4,0.4; 29 -4,-0.4; 30 -4,-1.2; 31 -4,-2; 32 -4,-2.8
RK097 = drill 1: 1 2.5,0; 2 0,0; 3 -2.5,0; 4 2.5,-2.5; 5 0,-2.5; 6 -2.5,-2.5
STX3100 = drill 1.5 pad 2.54: 1 2.7,-0.1 | drill 1.5: 2 7.7,5; 3 7.7,2.3; 4 7.7,-2.5; 5 7.7,-5.2 | hole 1.5: 2.7,4.9; 2.7,-5.1; 7.7,-0.1

### Placement (x,y rotation side)
C1  -37.59,101.8 90 top  (outside the outline)
C2  -37.39,97.13 270 top  (outside the outline)
C3  247.9,89 0 top  (outside the outline)
C4  -38.2,79.25 0 top  (outside the outline)
C5  -21.13,141.22 90 top  (outside the outline)
C6  -21.74,135.53 180 top  (outside the outline)
C7  -42.27,153.62 270 top  (outside the outline)
C8  -61.98,153.62 270 top  (outside the outline)
C9  -58.12,63.4 0 top  (outside the outline)
C10  -58.12,58.32 0 top  (outside the outline)
C11  -57.51,51.82 0 top  (outside the outline)
C12  4.67,154.23 270 top  (outside the outline)
C13  6.5,154.23 270 bottom  (outside the outline)
C14  12.4,154.23 270 top  (outside the outline)
C15  10.57,154.23 270 bottom  (outside the outline)
C16  12.4,145.9 270 top  (outside the outline)
C17  4.67,145.9 270 top  (outside the outline)
C18  10.57,145.9 270 bottom  (outside the outline)
C19  6.5,145.9 270 bottom  (outside the outline)
C20  -16.46,158.29 180 top  (outside the outline)
C21  -16.66,146.71 0 top  (outside the outline)
C22  4.67,162.56 270 top  (outside the outline)
C23  12.4,162.56 270 top  (outside the outline)
C24  10.57,162.56 270 bottom  (outside the outline)
C25  6.5,162.56 270 bottom  (outside the outline)
C26  -86.36,76.81 0 top  (outside the outline)
C27  -86.36,73.96 0 top  (outside the outline)
C28  -126.19,-36.17 0 top  (outside the outline)
C29  -126.19,-40.03 0 top  (outside the outline)
C30  -86.36,65.43 0 top  (outside the outline)
C31  -86.36,62.59 0 top  (outside the outline)
C32  -86.36,59.74 0 top  (outside the outline)
C33  -86.36,56.9 0 top  (outside the outline)
C34  -86.36,54.05 0 top  (outside the outline)
C35  -86.36,51.21 0 top  (outside the outline)
C36  -86.36,48.36 0 top  (outside the outline)
C37  -86.36,45.52 0 top  (outside the outline)
C38  -126.19,-43.89 0 top  (outside the outline)
C39  -126.19,-47.75 0 top  (outside the outline)
C40  -6.1,141.22 90 top  (outside the outline)
C41  -6.71,135.53 180 top  (outside the outline)
C42  -126.19,-67.06 0 top  (outside the outline)
C43  -126.19,-74.78 0 top  (outside the outline)
C44  -126.19,-82.5 0 top  (outside the outline)
C45  -126.19,-86.36 0 top  (outside the outline)
C46  -126.19,-90.22 0 top  (outside the outline)
C47  -126.19,-94.08 0 top  (outside the outline)
C48  -24.59,143.05 90 top  (outside the outline)
C49  -9.55,143.05 90 top  (outside the outline)
C50  -71.73,24.18 0 top  (outside the outline)
C51  -27.03,20.93 0 top  (outside the outline)
C52  -27.03,16.05 0 top  (outside the outline)
C59  -71.73,55.07 0 top  (outside the outline)
C60  -71.73,47.35 0 top  (outside the outline)
C61  -71.73,39.62 0 top  (outside the outline)
C62  -71.73,31.9 0 top  (outside the outline)
C63  -71.73,20.32 0 top  (outside the outline)
C64  -71.73,4.88 0 top  (outside the outline)
C65  -71.73,1.02 0 top  (outside the outline)
C66  194.46,67.06 0 top  (outside the outline)
C67  194.46,63.2 0 top  (outside the outline)
C68  162.56,40.84 0 top
C69  162.56,21.54 0 top
C70  205.44,67.87 0 top  (outside the outline)
C71  205.03,51.41 0 top  (outside the outline)
C72  203.81,37.8 0 top  (outside the outline)
C73  203.81,29.06 0 top  (outside the outline)
C82  224.74,96.93 0 top  (outside the outline)
C83  224.74,88.19 0 top  (outside the outline)
C84  224.74,79.45 0 top  (outside the outline)
C85  224.33,72.75 0 top  (outside the outline)
C86  224.33,67.67 0 top  (outside the outline)
C87  224.33,62.59 0 top  (outside the outline)
C88  224.33,48.36 0 top  (outside the outline)
C89  224.74,36.98 0 top  (outside the outline)
C90  231.65,29.26 0 top  (outside the outline)
C91  220.27,20.52 0 top  (outside the outline)
C92  221.69,3.25 0 top  (outside the outline)
C93  252.58,108.1 0 top  (outside the outline)
C94  252.58,105.26 0 top  (outside the outline)
C95  222.3,159.72 0 top  (outside the outline)
C96  220.88,145.08 0 top  (outside the outline)
C97  -41.45,59.13 0 top  (outside the outline)
C98  -41.45,55.27 0 top  (outside the outline)
C99  -41.45,51.41 0 top  (outside the outline)
C100  247.5,82.09 0 top  (outside the outline)
C101  247.5,84.94 0 top  (outside the outline)
C102  -17.07,133.91 180 top  (outside the outline)
C103  -2.03,133.91 180 top  (outside the outline)
C104  -16.87,141.22 0 top  (outside the outline)
C105  -1.83,141.22 0 top  (outside the outline)
C106  247.5,63.8 0 top  (outside the outline)
C107  247.5,59.94 0 top  (outside the outline)
C108  -6.71,133.91 180 top  (outside the outline)
C109  -6.71,132.28 180 top  (outside the outline)
C110  -6.71,130.66 180 top  (outside the outline)
C111  -6.71,129.03 180 top  (outside the outline)
C112  -21.74,133.91 180 top  (outside the outline)
C113  -21.74,132.28 180 top  (outside the outline)
C114  -21.74,130.66 180 top  (outside the outline)
C115  -21.74,129.03 180 top  (outside the outline)
C116  247.9,21.74 0 top  (outside the outline)
C117  247.9,17.48 0 top  (outside the outline)
C118  247.9,13.21 0 top  (outside the outline)
C119  247.9,8.94 0 top  (outside the outline)
CN1  6.3,3.86 0 top
L1  239.57,7.52 0 top  (outside the outline)
LED_DAC  -40.64,42.67 0 top  (outside the outline)
LED_MUTE  -40.64,38.2 0 top  (outside the outline)
LED_PWR  -40.64,47.14 0 top  (outside the outline)
OA7  166.42,158.7 0 top  (outside the outline)
OA8  166.42,153.42 0 top  (outside the outline)
OA9  172.52,156.06 0 top  (outside the outline)
OA10  -132.08,-12.4 0 top  (outside the outline)
OA11  -124.76,-24.38 0 top  (outside the outline)
OA12  -124.76,-30.89 0 top  (outside the outline)
Q1  71.93,157.48 90 top  (outside the outline)
R1  -36.98,95.1 0 top  (outside the outline)
R2  -33.12,104.04 0 top  (outside the outline)
R3  -32.31,95.1 0 top  (outside the outline)
R4  -34.75,79.65 0 top  (outside the outline)
R5  -31.9,79.45 0 top  (outside the outline)
R6  -28.85,79.04 0 top  (outside the outline)
R7  -17.07,132.69 0 top  (outside the outline)
R8  -17.07,131.47 180 top  (outside the outline)
R9  -17.07,130.25 0 top  (outside the outline)
R10  -2.03,132.69 0 top  (outside the outline)
R11  -2.03,131.47 180 top  (outside the outline)
R12  -2.03,130.25 0 top  (outside the outline)
R13  -27.23,36.98 0 top  (outside the outline)
R14  -27.23,34.14 0 top  (outside the outline)
R15  -27.23,31.29 0 top  (outside the outline)
R16  -27.23,28.45 0 top  (outside the outline)
R17  -27.23,11.99 0 top  (outside the outline)
R18  -27.23,8.13 0 top  (outside the outline)
R19  -27.23,4.27 0 top  (outside the outline)
R20  -71.73,57.91 0 top  (outside the outline)
R21  -71.73,51.21 0 top  (outside the outline)
R22  -71.73,43.48 0 top  (outside the outline)
R23  -71.73,35.76 0 top  (outside the outline)
R24  -71.73,28.04 0 top  (outside the outline)
R25  -71.73,16.46 0 top  (outside the outline)
R26  -71.73,12.6 0 top  (outside the outline)
R27  -71.73,8.74 0 top  (outside the outline)
R28  194.46,90.22 0 top  (outside the outline)
R29  194.46,86.36 0 top  (outside the outline)
R30  194.46,82.5 0 top  (outside the outline)
R31  194.46,78.64 0 top  (outside the outline)
R32  194.46,74.78 0 top  (outside the outline)
R33  194.46,70.92 0 top  (outside the outline)
R34  -126.19,-51.61 0 top  (outside the outline)
R35  194.46,55.47 0 top  (outside the outline)
R36  -126.19,-55.47 0 top  (outside the outline)
R37  194.46,47.75 0 top  (outside the outline)
R38  -126.19,-70.92 0 top  (outside the outline)
R39  -123.14,-70.92 0 top  (outside the outline)
R40  -126.19,-78.64 0 top  (outside the outline)
R41  -123.14,-78.64 0 top  (outside the outline)
R42  -126.19,-97.94 0 top  (outside the outline)
R43  -126.19,-101.8 0 top  (outside the outline)
R44  -126.19,-105.66 0 top  (outside the outline)
R45  -126.19,-109.52 0 top  (outside the outline)
R46  -125.37,-113.79 0 top  (outside the outline)
R47  -125.37,-117.04 0 top  (outside the outline)
R48  -125.37,-120.29 0 top  (outside the outline)
R49  -125.37,-123.55 0 top  (outside the outline)
R50  162.56,29.26 0 top
R51  162.56,25.4 0 top
R52  162.56,17.68 0 top
R53  162.56,13.82 0 top
R54  211.12,28.85 0 top  (outside the outline)
R55  -41.45,62.99 0 top  (outside the outline)
R56  211.53,21.74 0 top  (outside the outline)
R57  -41.45,34.14 0 top  (outside the outline)
R58  -41.45,30.28 0 top  (outside the outline)
R59  -41.45,26.42 0 top  (outside the outline)
R60  247.29,4.88 0 top  (outside the outline)
R61  -105.05,-7.72 0 top  (outside the outline)
R62  -105.05,-11.58 0 top  (outside the outline)
R63  -105.05,-15.44 0 top  (outside the outline)
R64  -105.05,-19.3 0 top  (outside the outline)
R65  -126.19,-59.33 0 top  (outside the outline)
R66  -126.19,-63.2 0 top  (outside the outline)
RECT1  8.53,162.56 180 top  (outside the outline)
RECT2  8.53,154.23 180 top  (outside the outline)
RECT3  8.53,145.9 180 top  (outside the outline)
S1  185.52,57.1 0 top  (outside the outline)
S2  209.7,89.2 0 top  (outside the outline)
S3  213.56,40.84 0 top  (outside the outline)
S4  -102.41,-0.81 0 top  (outside the outline)
U1  159.11,156.06 0 top  (outside the outline)
U$1  -94.69,138.38 0 top  (outside the outline)
U$2  -84.53,138.38 0 top  (outside the outline)
U$3  63.2,157.07 0 top  (outside the outline)
U$6  -17.07,137.57 0 top  (outside the outline)
U$7  -2.03,137.57 0 top  (outside the outline)
U$10  41.25,4.67 180 top
X1  20.32,-0.61 90 top
X2  62.18,-0.61 90 top

### Tracks (layer width: path | path; a pad name or v marks a point on that pad's centre or on a via)
3.3V  (via drill 0.6)  (17 unrouted)
  Top 0.305: R7.P$1 C102.P$2 -18.37,134.46 U$6.1
  other vias: -19.51,129.03 -19.51,130.45 -19.51,131.88 -19.51,133.3 -19.51,134.72
  pour Top (no thermals): -19.1,136.35 -21.54,136.35 -21.54,128.22 -18.49,128.22 -18.49,135.53 -19.1,135.53
5V  (via drill 0.6)  (11 unrouted)
  Top 0.305: U$7.1 -3.33,134.46 C103.P$2 R10.P$1
  other vias: -4.47,129.03 -4.47,130.45 -4.47,131.88 -4.47,133.3 -4.47,134.72
  pour Top (no thermals): -4.06,136.35 -6.5,136.35 -6.5,128.22 -3.45,128.22 -3.45,134.72 -3.25,134.72 -3.25,135.53 -4.06,135.53
6V3_RAW  (via drill 0.33)  (4 unrouted)
  Top 0.305: C22.2 4.67,160.12 5.28,159.51 6.3,159.51 RECT1.1 6.43,162.09 6.91,162.56 8.33,162.56 v9.35,161.54
  Bottom 0.305: C24.2 9.41,161.61 v9.35,161.54
  pour Top (no thermals): -10.97,141.22 -3.25,141.22 -3.25,139.6 -4.06,139.6 -4.06,138.79 -10.97,138.79
  pour Top (no thermals): -18.29,139.6 -19.1,139.6 -19.1,138.79 -26.01,138.79 -26.01,141.22 -18.29,141.22
BCK  (1 unrouted)
D+  (1 unrouted)
D-  (1 unrouted)
DATA  (1 unrouted)
GAIN_L  (3 unrouted)
GAIN_R  (3 unrouted)
GND  (via drill 0.33)  (142 unrouted)
  Top 0.305: C23.2 12.39,160.12 11.79,159.51 10.77,159.51 RECT1.4 8.6,159.65 7.92,160.32 7.92,161.34 v7.72,161.54 | C14.2 12.39,152.2 11.52,151.32 RECT2.4 8.6,151.32 7.92,151.99 7.92,153.01 v7.72,153.21 | C17.2 4.67,143.87 5.55,142.99 RECT3.1 6.43,145.42 6.91,145.9 8.33,145.9 v9.35,144.88
  Bottom 0.305: C25.2 7.66,161.61 v7.72,161.54 | C13.2 7.66,153.28 v7.72,153.21 | v9.35,144.88 10.5,144.88 C18.2
HP_IN_L  (1 unrouted)
HP_IN_R  (1 unrouted)
HP_OUT_L  (2 unrouted)
HP_OUT_R  (2 unrouted)
LRCK  (1 unrouted)
MUTE  (1 unrouted)
N$1
  Top 0.305: R10.P$2 R11.P$1
N$2  (1 unrouted)
N$3  (3 unrouted)
N$4  (1 unrouted)
N$5  (1 unrouted)
N$6
  Top 0.305: R11.P$2 R12.P$1 -2.44,130.25 -2.03,130.66 -2.03,133.91 | -2.03,133.91 U$7.3 | C103.P$1 -2.03,133.91
N$7  (1 unrouted)
N$8  (3 unrouted)
N$9  (2 unrouted)
  Top 0.254: U1.25 164.39,158.34 164.39,156.26 166.17,156.26 OA7.2
N$10  (3 unrouted)
N$11  (3 unrouted)
N$12  (via drill 0.33)
  Top 0.305: v7.72,157.07 6.5,157.07 RECT2.2 6.3,157.28 6.3,157.08 6.3,157.07 5.49,157.07 4.67,156.26 C12.1
  Bottom 0.305: C13.1 6.5,155.85 v7.72,157.07
N$13  (via drill 0.33)
  Top 0.305: v9.35,157.07 10.57,157.07 RECT2.3 10.7,157.07 11.58,157.07 12.39,156.26 C14.1
  Bottom 0.305: C15.1 10.57,155.85 v9.35,157.07
N$14  (1 unrouted)
N$15  (5 unrouted)
N$16  (3 unrouted)
N$17
  Top 0.305: R7.P$2 R8.P$1
N$18
  Top 0.305: U$6.3 -17.07,133.91 | -17.07,133.91 -17.07,130.66 -17.48,130.25 R9.P$1 R8.P$2 | C102.P$1 -17.07,133.91
N$19  (1 unrouted)
N$20  (3 unrouted)
N$21  (2 unrouted)
  Top 0.254: U1.17 164.39,153.14 164.39,150.77 166.17,150.77 OA8.2
N$22  (2 unrouted)
  Top 0.254: U1.18 164.39,153.77 164.39,155.65 166.67,155.65 OA8.6
N$23  (via drill 0.33)
  Top 0.305: C23.1 12.39,164.59 11.52,165.47 RECT1.3 9.41,165.47 v9.35,165.41
  Bottom 0.305: C24.1 10.57,164.19 v9.35,165.41
N$24  (via drill 0.33)
  Top 0.305: C22.1 4.67,164.59 5.55,165.47 RECT1.2 7.66,165.47 v7.72,165.41
  Bottom 0.305: C25.1 6.5,164.19 v7.72,165.41
N$25  (1 unrouted)
N$26  (3 unrouted)
N$27  (2 unrouted)
N$28  (2 unrouted)
N$29  (2 unrouted)
N$30  (3 unrouted)
N$31  (2 unrouted)
  Top 0.254: U1.26 164.39,158.98 164.39,161.14 166.67,161.14 OA7.6
N$32  (1 unrouted)
N$33  (1 unrouted)
N$34  (3 unrouted)
N$35  (3 unrouted)
N$36  (2 unrouted)
N$37  (2 unrouted)
N$38  (2 unrouted)
N$39  (2 unrouted)
N$40  (2 unrouted)
N$41  (2 unrouted)
N$42  (2 unrouted)
N$48  (2 unrouted)
N$49  (2 unrouted)
N$50  (3 unrouted)
N$51  (1 unrouted)
N$52  (1 unrouted)
N$53  (3 unrouted)
N$54
  Top 0.305: U$6.14 -17.72,141.12 C104.P$1
N$55
  Top 0.305: U$7.14 -2.68,141.12 C105.P$1
N$56  (2 unrouted)
N$57  (2 unrouted)
N$62  (3 unrouted)
N$66  (2 unrouted)
N$67  (2 unrouted)
N$72  (via drill 0.33)
  Top 0.305: C16.1 12.39,147.93 11.52,148.81 RECT3.3 10.57,148.74 v9.35,148.74
  Bottom 0.305: C18.1 10.57,147.52 v9.35,148.74
N$73  (3 unrouted)
N$74  (2 unrouted)
N$77  (via drill 0.33)
  Top 0.305: C17.1 4.67,147.93 5.55,148.81 RECT3.2 6.5,148.74 v7.72,148.74
  Bottom 0.305: C19.1 6.5,147.52 v7.72,148.74
N$78  (1 unrouted)
N$79  (1 unrouted)
N$80  (3 unrouted)
N$81  (2 unrouted)
N$82  (3 unrouted)
N$83  (1 unrouted)
N$84  (1 unrouted)
N$85  (1 unrouted)
N$86  (1 unrouted)
PWR_EN_NEG  (1 unrouted)
PWR_EN_POS  (1 unrouted)
SCK  (1 unrouted)
USB_D+  (2 unrouted)
USB_D-  (1 unrouted)
USB_VBUS  (1 unrouted)
V+_RAW  (via drill 0.33)  (7 unrouted)
  Top 0.305: C12.2 4.67,152.2 5.55,151.32 RECT2.1 6.43,153.75 6.91,154.23 8.33,154.23 v9.35,153.21
  Bottom 0.305: v9.35,153.21 10.5,153.21 C15.2
V-_RAW  (via drill 0.33)  (7 unrouted)
  Top 0.305: C16.2 12.39,143.87 11.52,142.99 RECT3.4 8.6,142.99 7.92,143.66 7.92,144.68 v7.72,144.88
  Bottom 0.305: v7.72,144.88 6.57,144.88 C19.2
VBUS  (4 unrouted)
VCC  (28 unrouted)
VEE  (24 unrouted)
(copper drawn outside any net)
  shapes: Bottom area x2